# Altium schematic sheet BUCKEDUP.SchDoc
size A4; SheetNumber: 3; SheetTotal: 3
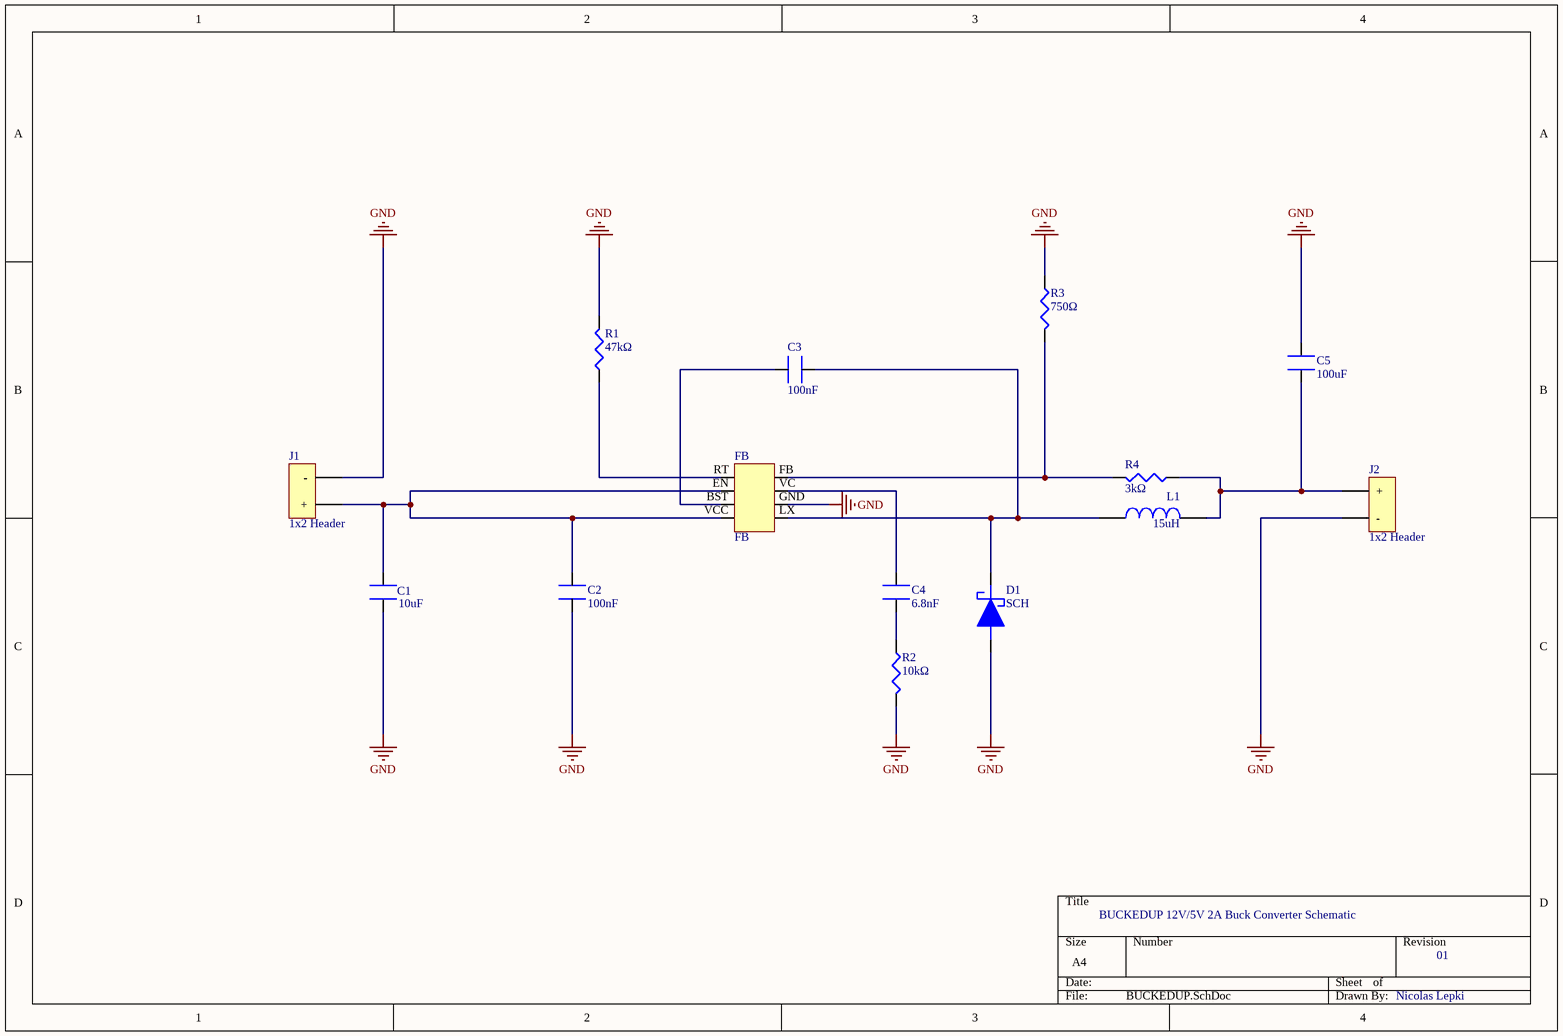
[diagram p0: BUCKEDUP.SchDoc]

## Parts
C1  10uF
C2  100nF
C3  100nF
C4  6.8nF
C5  100uF
D1  SCH
FB  FB
J1  1x2 Header
J2  1x2 Header
L1  15uH
R1  47kΩ
R2  10kΩ
R3  750Ω
R4  3kΩ

## Nets
GND: C1.2 C2.2 C5.2 D1.1 FB.GND J1.2(-) J2.2(-) R1.2 R2.2 R3.1
NetC1_1: C1.1 C2.1 FB.EN FB.VCC J1.1(+)
NetC3_1: C3.1 FB.BST
NetC3_2: C3.2 D1.2 FB.LX L1.1
NetC4_1: C4.1 FB.VC
NetC4_2: C4.2 R2.1
NetC5_1: C5.1 J2.1(+) L1.2 R4.1
NetFB_FB: FB.FB R3.2 R4.2
NetFB_RT: FB.RT R1.1

## Notes on the sheet
- BUCKEDUP 12V/5V 2A Buck Converter Schematic
- 01
- Nicolas Lepki

## Library data of the parts
C1 = KAM32LR71H106KL: 10uF Ceramic Capacitor, Multilayer, Ceramic, 50V, 10% +Tol, 10% -Tol, X7R, 15% TC, 10uF, Surface Mount, 1210; Manufacturer: KYOCERA AVX; Value: 10µF; Supplier: Mouser; Supplier Part Number: 581-KAM32LR71H106KL; Manufacturer Part Number: KAM32LR71H106KL; RoHS: Compliant; Category: Ceramic Capacitors; Stock: 8258; Dielectric Material: Ceramic; Height: 2.8mm; Length: 3.2mm; Lifecycle Status: Production; Max Operating Temperature: 125°C; Min Operating Temperature: -55°C; Mounting Technology: Surface Mount; Number of Terminals: 2; REACH SVHC: Yes; Voltage Rating (DC): 50V; Width: 2.5mm; ComponentLink1URL: https://datasheet.octopart.com:443/KAM32LR71H106KL-KYOCERA-AVX-datasheet-168937811.pdf?src-supplier=IHS; ComponentLink1Description: https://datasheet.octopart.com:443/KAM32LR71H106KL-KYOCERA-AVX-datasheet-168937811.pdf?src-supplier=IHS
C2 C3 = CL10F104ZB8NNNC: 0.1 uF Ceramic Capacitor, Multilayer, Ceramic, 50V, 80% +Tol, 20% -Tol, Y5V, -82~+22% TC, 100nF, Surface Mount, 0603 inch; Manufacturer: Samsung Electro-Mechanics; Supplier: Avnet; Supplier Part Number: CL10F104ZB8NNNC; Manufacturer Part Number: CL10F104ZB8NNNC; RoHS: Compliant; Category: Ceramic Capacitors; Stock: 108000; Value: 100nF; Case/Package: 0603; Case Code (Imperial): 0603; Case Code (Metric): 1608; China RoHS: Compliant; Contact Plating: Tin; Depth: 800µm; Dielectric: Y5V; Dielectric Material: Ceramic; Height: 800µm; Length: 1.6mm; Lifecycle Status: Production; Material: Ceramic; Max Operating Temperature: 85°C; Min Operating Temperature: -55°C; Mounting Technology: Surface Mount; Number of Terminals: 2; Radiation Hardening: No; REACH SVHC: Yes; Schedule B: 8532240020, 8532240020|8532240020|8532240020|8532240020|8532240020; Thickness: 889µm; Tolerance: 80%; Voltage: 50V; Voltage Rating: 50V; Voltage Rating (DC): 50V; Width: 800µm; ComponentLink1URL: https://datasheet.octopart.com:443/CL10F104ZB8NNNC-Samsung-Electro-Mechanics-datasheet-136482459.pdf?src-supplier=IHS; ComponentLink1Description: https://datasheet.octopart.com:443/CL10F104ZB8NNNC-Samsung-Electro-Mechanics-datasheet-136482459.pdf?src-supplier=IHS; ComponentLink2URL: https://datasheet.octopart.com:443/CL10F104ZB8NNNC-Samsung-Electro-Mechanics-datasheet-116891008.pdf?src-supplier=Future+Electronics; ComponentLink2Description: https://datasheet.octopart.com:443/CL10F104ZB8NNNC-Samsung-Electro-Mechanics-datasheet-116891008.pdf?src-supplier=Future+Electronics; ComponentLink3URL: https://datasheet.octopart.com:443/CL10F104ZB8NNNC-Samsung-Electro-Mechanics-datasheet-81462095.pdf?src-supplier=Future+Electronics; ComponentLink3Description: https://datasheet.octopart.com:443/CL10F104ZB8NNNC-Samsung-Electro-Mechanics-datasheet-81462095.pdf?src-supplier=Future+Electronics; ComponentLink4URL: https://datasheet.octopart.com:443/CL10F104ZB8NNNC-Samsung-datasheet-48647485.pdf?src-supplier=Future+Electronics; ComponentLink4Description: https://datasheet.octopart.com:443/CL10F104ZB8NNNC-Samsung-datasheet-48647485.pdf?src-supplier=Future+Electronics; ComponentLink5URL: https://datasheet.octopart.com:443/CL10F104ZB8NNNC-Samsung-datasheet-12535901.pdf?src-supplier=Future+Electronics; ComponentLink5Description: https://datasheet.octopart.com:443/CL10F104ZB8NNNC-Samsung-datasheet-12535901.pdf?src-supplier=Future+Electronics; ComponentLink6URL: https://datasheet.octopart.com:443/CL10F104ZB8NNNC-Samsung-datasheet-26669208.pdf?src-supplier=Future+Electronics; ComponentLink6Description: https://datasheet.octopart.com:443/CL10F104ZB8NNNC-Samsung-datasheet-26669208.pdf?src-supplier=Future+Electronics; ComponentLink7URL: https://datasheet.octopart.com:443/CL10F104ZB8NNNC-Samsung-Electro-Mechanics-datasheet-149136954.pdf?src-supplier=Future+Electronics; ComponentLink7Description: https://datasheet.octopart.com:443/CL10F104ZB8NNNC-Samsung-Electro-Mechanics-datasheet-149136954.pdf?src-supplier=Future+Electronics; ComponentLink8URL: https://datasheet.octopart.com/CL10F104ZB8NNNC-Samsung-Electro-Mechanics-datasheet-97040617.pdf; ComponentLink8Description: https://datasheet.octopart.com/CL10F104ZB8NNNC-Samsung-Electro-Mechanics-datasheet-97040617.pdf; ComponentLink9URL: https://datasheet.octopart.com/CL10F104ZB8NNNC-Samsung-Electro-Mechanics-datasheet-8324245.pdf; ComponentLink9Description: https://datasheet.octopart.com/CL10F104ZB8NNNC-Samsung-Electro-Mechanics-datasheet-8324245.pdf; ComponentLink10URL: https://datasheet.octopart.com:443/CL10F104ZB8NNNC-Samsung-datasheet-59220082.pdf?src-supplier=TME; ComponentLink10Description: https://datasheet.octopart.com:443/CL10F104ZB8NNNC-Samsung-datasheet-59220082.pdf?src-supplier=TME
C4 = CC0402JRX7R9BB682: 6.8nF Ceramic Capacitor, Ceramic, 50V, 5% +Tol, 5% -Tol, X7R, 15% TC, 0.0068uF, Surface Mount, 0402; Manufacturer: Yageo Group; Supplier: Avnet; Supplier Part Number: CC0402JRX7R9BB682; Manufacturer Part Number: CC0402JRX7R9BB682; RoHS: Compliant; Category: Ceramic Capacitors; Stock: 10000; Value: 6.8nF; Case/Package: 0402; Case Code (Imperial): 0402; Case Code (Metric): 1005; China RoHS: Compliant; Composition: Ceramic; Depth: 500µm; Dielectric: X7R; Dielectric Material: Ceramic; Halogen Free: Halogen Free; Height: 500µm; Lead Free: Lead Free; Length: 1mm; Lifecycle Status: Production; Max Operating Temperature: 125°C; Min Operating Temperature: -55°C; Mounting Technology: Surface Mount; Number of Terminals: 2; Packaging: Tape and Reel; REACH SVHC: Yes; Schedule B: 8532240020, 8532240020|8532240020|8532240020|8532240020|8532240020; Termination: SMD/SMT; Thickness: 558.8µm; Tolerance: 5%; Voltage Rating: 50V; Voltage Rating (DC): 50V; Weight: 652.039032µg; Width: 500µm; ComponentLink1URL: https://datasheet.octopart.com:443/CC0402JRX7R9BB682-Yageo-datasheet-177165144.pdf?src-supplier=IHS; ComponentLink1Description: https://datasheet.octopart.com:443/CC0402JRX7R9BB682-Yageo-datasheet-177165144.pdf?src-supplier=IHS; ComponentLink2URL: https://datasheet.octopart.com:443/CC0402JRX7R9BB682-Yageo-Group-datasheet-189192896.pdf?src-supplier=TME; ComponentLink2Description: https://datasheet.octopart.com:443/CC0402JRX7R9BB682-Yageo-Group-datasheet-189192896.pdf?src-supplier=TME; ComponentLink3URL: https://datasheet.octopart.com:443/CC0402JRX7R9BB682-Yageo-datasheet-182878143.pdf?src-supplier=Newark; ComponentLink3Description: https://datasheet.octopart.com:443/CC0402JRX7R9BB682-Yageo-datasheet-182878143.pdf?src-supplier=Newark; ComponentLink4URL: https://datasheet.octopart.com:443/CC0402JRX7R9BB682-Yageo-datasheet-147453679.pdf?src-supplier=Newark; ComponentLink4Description: https://datasheet.octopart.com:443/CC0402JRX7R9BB682-Yageo-datasheet-147453679.pdf?src-supplier=Newark; ComponentLink5URL: https://datasheet.octopart.com:443/CC0402JRX7R9BB682-Yageo-Group-datasheet-165992755.pdf?src-supplier=ODG+(Origin+Data+Global); ComponentLink5Description: https://datasheet.octopart.com:443/CC0402JRX7R9BB682-Yageo-Group-datasheet-165992755.pdf?src-supplier=ODG+(Origin+Data+Global); ComponentLink6URL: https://datasheet.octopart.com:443/CC0402JRX7R9BB682-Yageo-datasheet-151948686.pdf?src-supplier=Farnell; ComponentLink6Description: https://datasheet.octopart.com:443/CC0402JRX7R9BB682-Yageo-datasheet-151948686.pdf?src-supplier=Farnell; ComponentLink7URL: https://datasheet.octopart.com:443/CC0402JRX7R9BB682-Yageo-datasheet-137875056.pdf?src-supplier=Future+Electronics; ComponentLink7Description: https://datasheet.octopart.com:443/CC0402JRX7R9BB682-Yageo-datasheet-137875056.pdf?src-supplier=Future+Electronics; ComponentLink8URL: https://datasheet.octopart.com/Surface-Mount-Ceramic-Multilayer-Capacitors%3B-General-Purpose-%26-High-Capacitance-Class-2%2C-X7R-Yageo-datasheet-family-114.pdf; ComponentLink8Description: https://datasheet.octopart.com/Surface-Mount-Ceramic-Multilayer-Capacitors%3B-General-Purpose-%26-High-Capacitance-Class-2%2C-X7R-Yageo-datasheet-family-114.pdf; ComponentLink9URL: https://datasheet.octopart.com/CC0402JRX7R9BB682-Yageo-datasheet-10883670.pdf; ComponentLink9Description: https://datasheet.octopart.com/CC0402JRX7R9BB682-Yageo-datasheet-10883670.pdf; ComponentLink10URL: http://sigma.octopart.com:80/rohs_statement/Surface-Mount-Ceramic-Multilayer-Capacitors%3B-General-Purpose-%26-High-Capacitance-Class-2%2C-X7R-Yageo-family-124.pdf?src-supplier=Compliance+Statements; ComponentLink10Description: http://sigma.octopart.com:80/rohs_statement/Surface-Mount-Ceramic-Multilayer-Capacitors%3B-General-Purpose-%26-High-Capacitance-Class-2%2C-X7R-Yageo-family-124.pdf?src-supplier=Compliance+Statements; ComponentLink11URL: http://sigma.octopart.com:80/reach_statement/Surface-Mount-Ceramic-Multilayer-Capacitors%3B-General-Purpose-%26-High-Capacitance-Class-2%2C-X7R-Yageo-family-125.pdf?src-supplier=Compliance+Statements; ComponentLink11Description: http://sigma.octopart.com:80/reach_statement/Surface-Mount-Ceramic-Multilayer-Capacitors%3B-General-Purpose-%26-High-Capacitance-Class-2%2C-X7R-Yageo-family-125.pdf?src-supplier=Compliance+Statements; ComponentLink12URL: http://sigma.octopart.com:80/rohs_statement/Yageo-company-2.pdf?src-supplier=Compliance+Statements; ComponentLink12Description: http://sigma.octopart.com:80/rohs_statement/Yageo-company-2.pdf?src-supplier=Compliance+Statements; ComponentLink13URL: http://sigma.octopart.com:80/conflict_mineral_statement/Yageo-company-3.pdf?src-supplier=Compliance+Statements; ComponentLink13Description: http://sigma.octopart.com:80/conflict_mineral_statement/Yageo-company-3.pdf?src-supplier=Compliance+Statements
C5 = EMK325ABJ107MM-T: 100uF 1210 16 V ±20% Tolerance X5R SMT Multilayer Ceramic Capacitor; Manufacturer: Taiyo Yuden; Value: 100µF; Voltage Rating: 16V; Supplier: Avnet; Supplier Part Number: EMK325ABJ107MM-T; Manufacturer Part Number: EMK325ABJ107MM-T; RoHS: Compliant; Category: Ceramic Capacitors; Stock: 98000; Case/Package: 1210; Case Code (Imperial): 1210; Case Code (Metric): 3225; Composition: Ceramic; Dielectric: X5R; Dielectric Material: Ceramic; Height: 2.5mm; Length: 3.2mm; Lifecycle Status: NRND; Material: Ceramic; Max Operating Temperature: 85°C; Min Operating Temperature: -55°C; Mounting Technology: Surface Mount; Number of Terminals: 2; REACH SVHC: Yes; Termination: SMD/SMT; Thickness: 2.6924mm; Tolerance: 20%; Voltage Rating (DC): 16V; Width: 2.5mm; ComponentLink1URL: https://datasheet.octopart.com:443/EMK325ABJ107MM-T-Taiyo-Yuden-datasheet-99833418.pdf?src-supplier=Upverter; ComponentLink1Description: https://datasheet.octopart.com:443/EMK325ABJ107MM-T-Taiyo-Yuden-datasheet-99833418.pdf?src-supplier=Upverter; ComponentLink2URL: https://datasheet.octopart.com:443/EMK325ABJ107MM-T-Taiyo-Yuden-datasheet-181961904.pdf?src-supplier=Newark; ComponentLink2Description: https://datasheet.octopart.com:443/EMK325ABJ107MM-T-Taiyo-Yuden-datasheet-181961904.pdf?src-supplier=Newark; ComponentLink3URL: https://datasheet.octopart.com:443/EMK325ABJ107MM-T-Taiyo-Yuden-datasheet-10742123.pdf?src-supplier=Newark; ComponentLink3Description: https://datasheet.octopart.com:443/EMK325ABJ107MM-T-Taiyo-Yuden-datasheet-10742123.pdf?src-supplier=Newark; ComponentLink4URL: https://datasheet.octopart.com:443/EMK325ABJ107MM-T-Taiyo-Yuden-datasheet-140424376.pdf?src-supplier=Master+Electronics; ComponentLink4Description: https://datasheet.octopart.com:443/EMK325ABJ107MM-T-Taiyo-Yuden-datasheet-140424376.pdf?src-supplier=Master+Electronics; ComponentLink5URL: https://datasheet.octopart.com:443/CEEMK325ABJ107MM-T-Taiyo-Yuden-datasheet-62282836.pdf?src-supplier=Master+Electronics; ComponentLink5Description: https://datasheet.octopart.com:443/CEEMK325ABJ107MM-T-Taiyo-Yuden-datasheet-62282836.pdf?src-supplier=Master+Electronics; ComponentLink6URL: https://datasheet.octopart.com:443/EMK325ABJ107MM-T-Taiyo-Yuden-datasheet-12472494.pdf?src-supplier=Master+Electronics; ComponentLink6Description: https://datasheet.octopart.com:443/EMK325ABJ107MM-T-Taiyo-Yuden-datasheet-12472494.pdf?src-supplier=Master+Electronics; ComponentLink7URL: https://datasheet.octopart.com:443/EMK325ABJ107MM-T-Taiyo-Yuden-datasheet-151661615.pdf?src-supplier=Farnell; ComponentLink7Description: https://datasheet.octopart.com:443/EMK325ABJ107MM-T-Taiyo-Yuden-datasheet-151661615.pdf?src-supplier=Farnell; ComponentLink8URL: https://datasheet.octopart.com:443/EMK325ABJ107MM-T-Taiyo-Yuden-datasheet-138738940.pdf?src-supplier=Electro+Sonic; ComponentLink8Description: https://datasheet.octopart.com:443/EMK325ABJ107MM-T-Taiyo-Yuden-datasheet-138738940.pdf?src-supplier=Electro+Sonic; ComponentLink9URL: https://datasheet.octopart.com:443/EMK325ABJ107MM-T-Taiyo-Yuden-datasheet-27088864.pdf?src-supplier=Electro+Sonic; ComponentLink9Description: https://datasheet.octopart.com:443/EMK325ABJ107MM-T-Taiyo-Yuden-datasheet-27088864.pdf?src-supplier=Electro+Sonic; ComponentLink10URL: https://datasheet.octopart.com:443/EMK325ABJ107MM-T-Taiyo-Yuden-datasheet-13693548.pdf?src-supplier=Electro+Sonic; ComponentLink10Description: https://datasheet.octopart.com:443/EMK325ABJ107MM-T-Taiyo-Yuden-datasheet-13693548.pdf?src-supplier=Electro+Sonic; ComponentLink11URL: https://datasheet.octopart.com:443/EMK325ABJ107MM-T-Taiyo-Yuden-datasheet-99833423.pdf?src-supplier=Future+Electronics; ComponentLink11Description: https://datasheet.octopart.com:443/EMK325ABJ107MM-T-Taiyo-Yuden-datasheet-99833423.pdf?src-supplier=Future+Electronics
D1 = YQ3VWM10BTR: Rectifier Diode, Schottky, 1 Phase, 1 Element, 3A, 100V V(RRM), Silicon; Manufacturer: ROHM; Forward Voltage: 880mV; Max Forward Surge Current (Ifsm): 30A; Number of Elements: 1; Peak Reverse Current: 10µA; Supplier: DigiKey; Supplier Part Number: 846-YQ3VWM10BTRCT-ND; Manufacturer Part Number: YQ3VWM10BTR; RoHS: Compliant; Category: Rectifier Diodes; Stock: 2829; Lifecycle Status: Production; Max Operating Temperature: 175°C; Max Output current: 3A; Number of Terminals: 2; REACH SVHC: Yes; Reverse Standoff Voltage: 100V; ComponentLink1URL: https://datasheet.octopart.com:443/YQ3VWM10BTR-ROHM-datasheet-187817658.pdf?src-supplier=Farnell; ComponentLink1Description: https://datasheet.octopart.com:443/YQ3VWM10BTR-ROHM-datasheet-187817658.pdf?src-supplier=Farnell
FB = BD9G341AEFJ-LBE2: DC/DC Buck Regulator, Adjustable, 12V to 76V In, 1V to 76V/3A Out, 750kHz, HTSOP-8; Manufacturer: ROHM; Max Output current: 3A; Nominal Supply Voltage: 48V; Nominal Output Voltage: 5V; Number of Channels: 1; Switching Frequency: 750µHz; Supplier: Avnet; Supplier Part Number: BD9G341AEFJ-LBE2; Manufacturer Part Number: BD9G341AEFJ-LBE2; RoHS: Compliant; Category: Voltage Regulators - Switching; Stock: 277500; Height - Seated (Max): 1mm; Length: 4.9mm; Lifecycle Status: Production; Max Supply Voltage: 76V; Max Operating Temperature: 85°C; Min Input Voltage: 12V; Min Operating Temperature: -40°C; Number of Circuits: 1; Number of Terminals: 8; Output Current: 3A; Output Voltage: 1V; REACH SVHC: Yes; Schedule B: 8542390000, 8542390000|8542390000, 8542390000|8542390000|8542390000, 8542390000|8542390000|8542390000|8542390000; Terminal Pitch: 1.27mm; Topology: Buck; Width: 3.9mm; ComponentLink1URL: https://datasheet.octopart.com:443/BD9G341AEFJ-LBE2-ROHM-datasheet-181218989.pdf?src-supplier=IHS; ComponentLink1Description: https://datasheet.octopart.com:443/BD9G341AEFJ-LBE2-ROHM-datasheet-181218989.pdf?src-supplier=IHS; ComponentLink2URL: https://datasheet.octopart.com:443/BD9G341AEFJ-LBE2-Rohm-datasheet-142141732.pdf?src-supplier=Rohm+SCT; ComponentLink2Description: https://datasheet.octopart.com:443/BD9G341AEFJ-LBE2-Rohm-datasheet-142141732.pdf?src-supplier=Rohm+SCT
J1 J2 = 08432: Screw Terminals 5MM Pitch (2-PIN; Manufacturer: SparkFun; Supplier: DigiKey; Supplier Part Number: 1568-08432-ND; Manufacturer Part Number: 08432; Category: Uncategorized
L1 = PM4343.153NLT: 15uH PA4343 Power Inductor, up to 55A, 6.5mm Max Height; Manufacturer: Pulse Electronics; DC Resistance (DCR): 28mΩ; Value: 15µH; Max Current Rating: 9A; Number of Circuits: 1; Shielding: Yes; Test Frequency: 100kHz; Tolerance: 20%; Supplier: DigiKey; Supplier Part Number: 553-PM4343.153NLTCT-ND; Manufacturer Part Number: PM4343.153NLT; RoHS: Compliant; Category: Fixed Inductors; Stock: 1789; Case/Package: 5550; Height: 6.5mm; Lifecycle Status: Production; Max Operating Temperature: 125°C; Min Operating Temperature: -40°C; Number of Terminals: 2; REACH SVHC: Yes; Width: 12.8mm; ComponentLink1URL: https://datasheet.octopart.com:443/PM4343.153NLT-Pulse-datasheet-150476422.pdf?src-supplier=ODG+(Origin+Data+Global); ComponentLink1Description: https://datasheet.octopart.com:443/PM4343.153NLT-Pulse-datasheet-150476422.pdf?src-supplier=ODG+(Origin+Data+Global)
R1 = RC0603FR-0747KL: 47kΩ Res Thick Film 0603 47K Ohm 1% 1/10W ±100ppm/°C Molded SMD Paper T/R; Manufacturer: Yageo Group; Max Power Dissipation: 100mW; Voltage Rating: 50V; Working Voltage: 75V; Supplier: Avnet; Supplier Part Number: RC0603FR-0747KL; Manufacturer Part Number: RC0603FR-0747KL; RoHS: Compliant; Category: Chip SMD Resistors; Stock: 630000; Value: 47kΩ; Case/Package: 0603; Case Code (Imperial): 0603; Case Code (Metric): 1608; China RoHS: Non-Compliant; Composition: Thick Film; Depth: 800µm; Features: Moisture Resistant; Height: 450µm; Lead Free: Lead Free; Length: 1.6mm; Lifecycle Status: Production; Max Operating Temperature: 155°C; Military Standard: Not; Min Operating Temperature: -55°C; Mounting Technology: Surface Mount; Pins: 2; Number of Terminals: 2; Number of Terminations: 2; Packaging: Tape and Reel; Power Dissipation: 100mW; Power Rating: 100mW; Radiation Hardening: No; REACH SVHC: Yes; Schedule B: 8533210045, 8533210045|8533210045|8533210045|8533210045|8533210045|8533210045|8533210045|8533210045|8533210045|8533210045|8533210045|8533210045|8533210045, 8533210045|8533210045|8533210045|8533210045|8533210045|8533210045|8533210045|8533210045|8533210045|8533210045|8533210045|8533210045|8533210045|8533210045, 8533210045|8533210045|8533210045|8533210045|8533210045|8533210045|8533210045|8533210045|8533210045|8533210045|8533210045|8533210045|8533210045|8533210045|8533210045; Temperature Coefficient: 100ppm/°C; Termination: SMD/SMT; Tolerance: 1%; Voltage Rating (AC): 50V; Voltage Rating (DC): 50V; Width: 800µm; ComponentLink1URL: https://datasheet.octopart.com:443/RC0603FR-0747KL-Yageo-datasheet-175887523.pdf?src-supplier=IHS; ComponentLink1Description: https://datasheet.octopart.com:443/RC0603FR-0747KL-Yageo-datasheet-175887523.pdf?src-supplier=IHS; ComponentLink2URL: https://datasheet.octopart.com:443/RC0603FR-0747KL-Yageo-datasheet-62067350.pdf?src-supplier=Newark; ComponentLink2Description: https://datasheet.octopart.com:443/RC0603FR-0747KL-Yageo-datasheet-62067350.pdf?src-supplier=Newark; ComponentLink3URL: https://datasheet.octopart.com:443/RC0603FR-0747KL-Yageo-datasheet-34211833.pdf?src-supplier=Newark; ComponentLink3Description: https://datasheet.octopart.com:443/RC0603FR-0747KL-Yageo-datasheet-34211833.pdf?src-supplier=Newark; ComponentLink4URL: https://datasheet.octopart.com:443/RC0603FR-0747KL-Yageo-datasheet-141265859.pdf?src-supplier=Upverter; ComponentLink4Description: https://datasheet.octopart.com:443/RC0603FR-0747KL-Yageo-datasheet-141265859.pdf?src-supplier=Upverter; ComponentLink5URL: https://datasheet.octopart.com:443/RC0603FR-0747KL-Yageo-datasheet-103092701.pdf?src-supplier=Upverter; ComponentLink5Description: https://datasheet.octopart.com:443/RC0603FR-0747KL-Yageo-datasheet-103092701.pdf?src-supplier=Upverter; ComponentLink6URL: https://sigma.octopart.com:443/138820526/technical_drawing/Yageo-RC0603FR-0747KL.pdf?src-supplier=Upverter; ComponentLink6Description: https://sigma.octopart.com:443/138820526/technical_drawing/Yageo-RC0603FR-0747KL.pdf?src-supplier=Upverter; ComponentLink7URL: https://datasheet.octopart.com:443/RC0603FR-0747KL-Yageo-datasheet-8328172.pdf?src-supplier=element14+APAC; ComponentLink7Description: https://datasheet.octopart.com:443/RC0603FR-0747KL-Yageo-datasheet-8328172.pdf?src-supplier=element14+APAC; ComponentLink8URL: https://datasheet.octopart.com:443/RC0603FR-0747KL-Yageo-datasheet-164759695.pdf?src-supplier=Future+Electronics; ComponentLink8Description: https://datasheet.octopart.com:443/RC0603FR-0747KL-Yageo-datasheet-164759695.pdf?src-supplier=Future+Electronics; ComponentLink9URL: https://datasheet.octopart.com:443/RC0603FR-0747KL-Yageo-datasheet-137700087.pdf?src-supplier=Future+Electronics; ComponentLink9Description: https://datasheet.octopart.com:443/RC0603FR-0747KL-Yageo-datasheet-137700087.pdf?src-supplier=Future+Electronics; ComponentLink10URL: https://datasheet.octopart.com:443/RC0603FR-0747KL-Yageo-datasheet-27584510.pdf?src-supplier=Future+Electronics; ComponentLink10Description: https://datasheet.octopart.com:443/RC0603FR-0747KL-Yageo-datasheet-27584510.pdf?src-supplier=Future+Electronics; ComponentLink11URL: https://datasheet.octopart.com:443/RC0603FR-0747KL-Yageo-datasheet-15599030.pdf?src-supplier=Future+Electronics; ComponentLink11Description: https://datasheet.octopart.com:443/RC0603FR-0747KL-Yageo-datasheet-15599030.pdf?src-supplier=Future+Electronics; ComponentLink12URL: https://datasheet.octopart.com:443/RC0603FR-0747KL-Yageo-datasheet-12596169.pdf?src-supplier=Future+Electronics; ComponentLink12Description: https://datasheet.octopart.com:443/RC0603FR-0747KL-Yageo-datasheet-12596169.pdf?src-supplier=Future+Electronics; ComponentLink13URL: https://datasheet.octopart.com:443/RC0603FR-0747KL-Yageo-datasheet-79472498.pdf?src-supplier=Megastar; ComponentLink13Description: https://datasheet.octopart.com:443/RC0603FR-0747KL-Yageo-datasheet-79472498.pdf?src-supplier=Megastar; ComponentLink14URL: https://datasheet.octopart.com/RC0603FR-0747KL-Yageo-datasheet-73766026.pdf; ComponentLink14Description: https://datasheet.octopart.com/RC0603FR-0747KL-Yageo-datasheet-73766026.pdf; ComponentLink15URL: https://datasheet.octopart.com:443/RC0603FR-0747KL-Yageo-datasheet-13691069.pdf?src-supplier=Farnell; ComponentLink15Description: https://datasheet.octopart.com:443/RC0603FR-0747KL-Yageo-datasheet-13691069.pdf?src-supplier=Farnell; ComponentLink16URL: https://datasheet.octopart.com:443/RC0603FR-0747KL-Yageo-datasheet-118562.pdf?src-supplier=DigiKey; ComponentLink16Description: https://datasheet.octopart.com:443/RC0603FR-0747KL-Yageo-datasheet-118562.pdf?src-supplier=DigiKey; ComponentLink17URL: https://datasheet.octopart.com:443/RC0603FR-0747KL-Yageo-datasheet-499455.pdf?src-supplier=element14; ComponentLink17Description: https://datasheet.octopart.com:443/RC0603FR-0747KL-Yageo-datasheet-499455.pdf?src-supplier=element14; ComponentLink18URL: http://sigma.octopart.com:80/rohs_statement/Yageo-company-2.pdf?src-supplier=Compliance+Statements; ComponentLink18Description: http://sigma.octopart.com:80/rohs_statement/Yageo-company-2.pdf?src-supplier=Compliance+Statements; ComponentLink19URL: http://sigma.octopart.com:80/conflict_mineral_statement/Yageo-company-3.pdf?src-supplier=Compliance+Statements; ComponentLink19Description: http://sigma.octopart.com:80/conflict_mineral_statement/Yageo-company-3.pdf?src-supplier=Compliance+Statements
R2 = RC0603FR-07100KL: 10kΩ 100Mw Thick Film Resistors 100Ppm/ 1% 10K 0603 Chip Resistor Surface Mount Rohs; Manufacturer: Yageo Group; Temperature Coefficient: 100ppm/°C; Voltage Rating: 75V; Voltage Rating (DC): 50V; Supplier: Avnet; Supplier Part Number: RC0603FR-07100KL; Manufacturer Part Number: RC0603FR-07100KL; RoHS: Compliant; Category: Chip SMD Resistors; Stock: 930000; Case/Package: 0603; Case Code (Imperial): 0603; Case Code (Metric): 0603; China RoHS: Non-Compliant; Composition: Thick Film; Depth: 800µm; Height: 450µm; Lead Free: Lead Free; Length: 1.6mm; Lifecycle Status: Production; Max Operating Temperature: 155°C; Military Standard: Not; Min Operating Temperature: -55°C; Mounting Technology: Surface Mount; Pins: 2; Number of Terminals: 2; Number of Terminations: 2; Packaging: Tape & Reel; Power Dissipation: 100mW; Power Rating: 100mW; REACH SVHC: Yes; Value: 10kΩ; Schedule B: 8533210045, 8533210045|8533210045, 8533210045|8533210045|8533210045, 8533210045|8533210045|8533210045|8533210045; Termination: SMD/SMT; Tolerance: 1%; Width: 800µm; Working Voltage: 75V; ComponentLink1URL: https://datasheet.octopart.com:443/RC0603FR-07100KL-Yageo-datasheet-175887523.pdf?src-supplier=IHS; ComponentLink1Description: https://datasheet.octopart.com:443/RC0603FR-07100KL-Yageo-datasheet-175887523.pdf?src-supplier=IHS; ComponentLink2URL: https://datasheet.octopart.com:443/RC0603FR-07100KL-Yageo-datasheet-8328172.pdf?src-supplier=element14+APAC; ComponentLink2Description: https://datasheet.octopart.com:443/RC0603FR-07100KL-Yageo-datasheet-8328172.pdf?src-supplier=element14+APAC; ComponentLink3URL: https://datasheet.octopart.com:443/RC0603FR-07100KL-Yageo-datasheet-17842380.pdf?src-supplier=element14+APAC; ComponentLink3Description: https://datasheet.octopart.com:443/RC0603FR-07100KL-Yageo-datasheet-17842380.pdf?src-supplier=element14+APAC; ComponentLink4URL: https://datasheet.octopart.com:443/RC0603FR-07100KL-Yageo-datasheet-141265859.pdf?src-supplier=Upverter; ComponentLink4Description: https://datasheet.octopart.com:443/RC0603FR-07100KL-Yageo-datasheet-141265859.pdf?src-supplier=Upverter; ComponentLink5URL: https://datasheet.octopart.com:443/RC0603FR-07100KL-Yageo-datasheet-103092701.pdf?src-supplier=Upverter; ComponentLink5Description: https://datasheet.octopart.com:443/RC0603FR-07100KL-Yageo-datasheet-103092701.pdf?src-supplier=Upverter; ComponentLink6URL: https://sigma.octopart.com:443/138820526/technical_drawing/Yageo-RC0603FR-07100KL.pdf?src-supplier=Upverter; ComponentLink6Description: https://sigma.octopart.com:443/138820526/technical_drawing/Yageo-RC0603FR-07100KL.pdf?src-supplier=Upverter; ComponentLink7URL: https://datasheet.octopart.com:443/RC0603FR-07100KL-Yageo-datasheet-98239111.pdf?src-supplier=Upverter; ComponentLink7Description: https://datasheet.octopart.com:443/RC0603FR-07100KL-Yageo-datasheet-98239111.pdf?src-supplier=Upverter; ComponentLink8URL: https://datasheet.octopart.com:443/RC0603FR-07100KL-Yageo-datasheet-12596169.pdf?src-supplier=Newark; ComponentLink8Description: https://datasheet.octopart.com:443/RC0603FR-07100KL-Yageo-datasheet-12596169.pdf?src-supplier=Newark; ComponentLink9URL: https://datasheet.octopart.com:443/RC0603FR-07100KL-Yageo-datasheet-34211833.pdf?src-supplier=Newark; ComponentLink9Description: https://datasheet.octopart.com:443/RC0603FR-07100KL-Yageo-datasheet-34211833.pdf?src-supplier=Newark; ComponentLink10URL: https://datasheet.octopart.com:443/RC0603FR-07100KL-Yageo-datasheet-62067350.pdf?src-supplier=Farnell; ComponentLink10Description: https://datasheet.octopart.com:443/RC0603FR-07100KL-Yageo-datasheet-62067350.pdf?src-supplier=Farnell; ComponentLink11URL: https://datasheet.octopart.com:443/RC0603FR-07100KL-Yageo-datasheet-13691069.pdf?src-supplier=Farnell; ComponentLink11Description: https://datasheet.octopart.com:443/RC0603FR-07100KL-Yageo-datasheet-13691069.pdf?src-supplier=Farnell; ComponentLink12URL: https://datasheet.octopart.com:443/RC0603FR-07100KL-Yageo-datasheet-164759695.pdf?src-supplier=Future+Electronics; ComponentLink12Description: https://datasheet.octopart.com:443/RC0603FR-07100KL-Yageo-datasheet-164759695.pdf?src-supplier=Future+Electronics; ComponentLink13URL: https://datasheet.octopart.com:443/RC0603FR-07100KL-Yageo-datasheet-137700087.pdf?src-supplier=Future+Electronics; ComponentLink13Description: https://datasheet.octopart.com:443/RC0603FR-07100KL-Yageo-datasheet-137700087.pdf?src-supplier=Future+Electronics; ComponentLink14URL: https://datasheet.octopart.com:443/RC0603FR-07100KL-Yageo-datasheet-27584510.pdf?src-supplier=Future+Electronics; ComponentLink14Description: https://datasheet.octopart.com:443/RC0603FR-07100KL-Yageo-datasheet-27584510.pdf?src-supplier=Future+Electronics; ComponentLink15URL: https://datasheet.octopart.com:443/RC0603FR-07100KL-Yageo-datasheet-15599030.pdf?src-supplier=Future+Electronics; ComponentLink15Description: https://datasheet.octopart.com:443/RC0603FR-07100KL-Yageo-datasheet-15599030.pdf?src-supplier=Future+Electronics; ComponentLink16URL: https://datasheet.octopart.com:443/RC0603FR-07100KL-Yageo-datasheet-8324193.pdf?src-supplier=Future+Electronics; ComponentLink16Description: https://datasheet.octopart.com:443/RC0603FR-07100KL-Yageo-datasheet-8324193.pdf?src-supplier=Future+Electronics; ComponentLink17URL: https://datasheet.octopart.com:443/RC0603FR-07100KL-Yageo-datasheet-79472498.pdf?src-supplier=Megastar; ComponentLink17Description: https://datasheet.octopart.com:443/RC0603FR-07100KL-Yageo-datasheet-79472498.pdf?src-supplier=Megastar; ComponentLink18URL: https://datasheet.octopart.com/RC0603FR-07100KL-Yageo-datasheet-73766026.pdf; ComponentLink18Description: https://datasheet.octopart.com/RC0603FR-07100KL-Yageo-datasheet-73766026.pdf; ComponentLink19URL: https://datasheet.octopart.com:443/RC0603FR-07100KL-Yageo-datasheet-30459151.pdf?src-supplier=Seeed+Studio; ComponentLink19Description: https://datasheet.octopart.com:443/RC0603FR-07100KL-Yageo-datasheet-30459151.pdf?src-supplier=Seeed+Studio; ComponentLink20URL: https://datasheet.octopart.com:443/RC0603FR-07100KL-Yageo-datasheet-118562.pdf?src-supplier=DigiKey; ComponentLink20Description: https://datasheet.octopart.com:443/RC0603FR-07100KL-Yageo-datasheet-118562.pdf?src-supplier=DigiKey; ComponentLink21URL: https://datasheet.octopart.com:443/RC0603FR-07100KL-Yageo-datasheet-503470.pdf?src-supplier=element14; ComponentLink21Description: https://datasheet.octopart.com:443/RC0603FR-07100KL-Yageo-datasheet-503470.pdf?src-supplier=element14; ComponentLink22URL: http://sigma.octopart.com:80/rohs_statement/Yageo-company-2.pdf?src-supplier=Compliance+Statements; ComponentLink22Description: http://sigma.octopart.com:80/rohs_statement/Yageo-company-2.pdf?src-supplier=Compliance+Statements; ComponentLink23URL: http://sigma.octopart.com:80/conflict_mineral_statement/Yageo-company-3.pdf?src-supplier=Compliance+Statements; ComponentLink23Description: http://sigma.octopart.com:80/conflict_mineral_statement/Yageo-company-3.pdf?src-supplier=Compliance+Statements
R3 = ERJ-3EKF75R0V: 750Ω Resistor Thick Film 0603 750 Ohm 1% 1/10W 100ppm/C Molded SMD Punched Carrier T/R; Manufacturer: Panasonic; Manufacturer Lifecycle Status: ACTIVE; Part Series: Precision Thick Film Chip Resistors; Max Power Dissipation: 100mW; Temperature Coefficient: 100ppm/°C; Voltage Rating: 75V; Supplier: Newark; Supplier Part Number: ERJ3EKF75R0V; Manufacturer Part Number: ERJ-3EKF75R0V; RoHS: Compliant; Category: Chip SMD Resistors; Stock: 30426; Pricing: 10=0.031, 100=0.018, 1000=0.016 (CAD); Case/Package: 0603; Case Code (Imperial): 0603; China RoHS: Non-Compliant; Composition: Thick Film; Contact Plating: Tin; Depth: 800µm; Features: Automotive AEC-Q200; Height: 450µm; Length: 1.6mm; Lifecycle Status: Production; Max Operating Temperature: 155°C; Military Standard: Not; Min Operating Temperature: -55°C; Mounting Technology: Surface Mount; Number of Terminals: 2; Number of Terminations: 2; Packaging: Cut Tape; Power Dissipation: 100mW; Power Rating: 100mW; Radiation Hardening: No; REACH SVHC: Yes; Value: 750Ω; Schedule B: 8533210045, 8533210045|8533210045|8533210045|8533210045|8533210045|8533210045|8533210045|8533210045|8533210045|8533210045|8533210045|8533210045|8533210045|8533210045|8533210045|8533210045|8533210045|8533210045|8533210045|8533210045|8533210045|8533210045|8533210045|85; Termination: SMD/SMT; Tolerance: 1%; Width: 800µm; Working Voltage: 75V; ComponentLink1URL: https://datasheet.octopart.com:443/ERJ-3EKF75R0V-Panasonic-datasheet-82288794.pdf?src-supplier=Panasonic; ComponentLink1Description: https://datasheet.octopart.com:443/ERJ-3EKF75R0V-Panasonic-datasheet-82288794.pdf?src-supplier=Panasonic; ComponentLink2URL: https://datasheet.octopart.com:443/ERJ-3EKF75R0V-Panasonic-datasheet-13266541.pdf?src-supplier=RS+(Formerly+Allied+Electronics); ComponentLink2Description: https://datasheet.octopart.com:443/ERJ-3EKF75R0V-Panasonic-datasheet-13266541.pdf?src-supplier=RS+(Formerly+Allied+Electronics); ComponentLink3URL: https://datasheet.octopart.com:443/ERJ-3EKF75R0V-Panasonic-datasheet-10025800.pdf?src-supplier=Future+Electronics; ComponentLink3Description: https://datasheet.octopart.com:443/ERJ-3EKF75R0V-Panasonic-datasheet-10025800.pdf?src-supplier=Future+Electronics; ComponentLink4URL: https://datasheet.octopart.com:443/ERJ-3EKF75R0V-Panasonic-datasheet-8853621.pdf?src-supplier=Future+Electronics; ComponentLink4Description: https://datasheet.octopart.com:443/ERJ-3EKF75R0V-Panasonic-datasheet-8853621.pdf?src-supplier=Future+Electronics; ComponentLink5URL: https://datasheet.octopart.com:443/ERJ-3EKF75R0V-Panasonic-datasheet-5313456.pdf?src-supplier=Newark; ComponentLink5Description: https://datasheet.octopart.com:443/ERJ-3EKF75R0V-Panasonic-datasheet-5313456.pdf?src-supplier=Newark; ComponentLink6URL: https://datasheet.octopart.com:443/ERJ-3EKF75R0V-Panasonic-datasheet-48891056.pdf?src-supplier=Newark; ComponentLink6Description: https://datasheet.octopart.com:443/ERJ-3EKF75R0V-Panasonic-datasheet-48891056.pdf?src-supplier=Newark; ComponentLink7URL: https://datasheet.octopart.com:443/ERJ-3EKF75R0V-Panasonic-datasheet-168681906.pdf?src-supplier=Farnell; ComponentLink7Description: https://datasheet.octopart.com:443/ERJ-3EKF75R0V-Panasonic-datasheet-168681906.pdf?src-supplier=Farnell; ComponentLink8URL: https://datasheet.octopart.com:443/ERJ-3EKF75R0V-Panasonic-datasheet-136608610.pdf?src-supplier=Farnell; ComponentLink8Description: https://datasheet.octopart.com:443/ERJ-3EKF75R0V-Panasonic-datasheet-136608610.pdf?src-supplier=Farnell; ComponentLink9URL: https://datasheet.octopart.com:443/ERJ-3EKF75R0V-Panasonic---ECG-datasheet-15994758.pdf?src-supplier=Farnell; ComponentLink9Description: https://datasheet.octopart.com:443/ERJ-3EKF75R0V-Panasonic---ECG-datasheet-15994758.pdf?src-supplier=Farnell; ComponentLink10URL: https://datasheet.octopart.com:443/ERJ-3EKF75R0V-Panasonic-datasheet-154766169.pdf?src-supplier=Master+Electronics; ComponentLink10Description: https://datasheet.octopart.com:443/ERJ-3EKF75R0V-Panasonic-datasheet-154766169.pdf?src-supplier=Master+Electronics; ComponentLink11URL: https://datasheet.octopart.com:443/ERJ3EKF75R0V-Panasonic-datasheet-138819429.pdf?src-supplier=Burklin+Elektronik; ComponentLink11Description: https://datasheet.octopart.com:443/ERJ3EKF75R0V-Panasonic-datasheet-138819429.pdf?src-supplier=Burklin+Elektronik; ComponentLink12URL: https://datasheet.octopart.com/ERJ-3EKF75R0V-Panasonic-datasheet-78375410.pdf; ComponentLink12Description: https://datasheet.octopart.com/ERJ-3EKF75R0V-Panasonic-datasheet-78375410.pdf; ComponentLink13URL: https://datasheet.octopart.com:443/ERJ-3EKF75R0V-Panasonic-datasheet-11542829.pdf?src-supplier=Arrow+Electronics; ComponentLink13Description: https://datasheet.octopart.com:443/ERJ-3EKF75R0V-Panasonic-datasheet-11542829.pdf?src-supplier=Arrow+Electronics; ComponentLink14URL: https://datasheet.octopart.com:443/ERJ-3EKF75R0V-Panasonic-datasheet-7538305.pdf?src-supplier=Jameco; ComponentLink14Description: https://datasheet.octopart.com:443/ERJ-3EKF75R0V-Panasonic-datasheet-7538305.pdf?src-supplier=Jameco; ComponentLink15URL: https://datasheet.octopart.com:443/ERJ-3EKF75R0V-Panasonic-datasheet-118621.pdf?src-supplier=DigiKey; ComponentLink15Description: https://datasheet.octopart.com:443/ERJ-3EKF75R0V-Panasonic-datasheet-118621.pdf?src-supplier=DigiKey; ComponentLink16URL: https://datasheet.octopart.com:443/ERJ-3EKF75R0V-Panasonic-datasheet-41391857.pdf?src-supplier=Electro+Sonic; ComponentLink16Description: https://datasheet.octopart.com:443/ERJ-3EKF75R0V-Panasonic-datasheet-41391857.pdf?src-supplier=Electro+Sonic
R4 = RMCF0603FT3K00: 3kΩ Res Thick Film 0603 3K Ohm 1% 0.1W(1/10W) ±100ppm/C Pad SMD Automotive T/R; Manufacturer: Stackpole Electronics; Max Power Dissipation: 100mW; Temperature Coefficient: 100ppm/°C; Voltage Rating: 75V; Supplier: Avnet; Supplier Part Number: RMCF0603FT3K00; Manufacturer Part Number: RMCF0603FT3K00; RoHS: Compliant; Category: Chip SMD Resistors; Stock: 75000; Case/Package: 0603; Case Code (Imperial): 0603; Case Code (Metric): 1608; China RoHS: Non-Compliant; Composition: Thick Film; Contact Plating: Tin; Features: Automotive AEC-Q200; Height: 450µm; Lead Free: Lead Free; Length: 1.5494mm; Lifecycle Status: Production; Max Operating Temperature: 155°C; Min Operating Temperature: -55°C; Mounting Technology: Surface Mount; Number of Terminals: 2; Number of Terminations: 2; Packaging: Tape & Reel (TR); Power Dissipation: 100mW; Power Rating: 100mW; Radiation Hardening: No; REACH SVHC: Yes; Value: 3kΩ; Schedule B: 8533210045, 8533210045|8533210045, 8533210045|8533210045|8533210045, 8533210045|8533210045|8533210045|8533210045; Tolerance: 1%; Width: 800µm; Working Voltage: 75V; ComponentLink1URL: https://datasheet.octopart.com:443/RMCF0603FT3K00-Stackpole-Electronics-datasheet-182148065.pdf?src-supplier=IHS; ComponentLink1Description: https://datasheet.octopart.com:443/RMCF0603FT3K00-Stackpole-Electronics-datasheet-182148065.pdf?src-supplier=IHS; ComponentLink2URL: https://datasheet.octopart.com:443/RMCF0603FT3K00-Stackpole-Electronics-datasheet-28504820.pdf?src-supplier=Future+Electronics; ComponentLink2Description: https://datasheet.octopart.com:443/RMCF0603FT3K00-Stackpole-Electronics-datasheet-28504820.pdf?src-supplier=Future+Electronics; ComponentLink3URL: https://datasheet.octopart.com:443/RMCF0603FT3K00-Stackpole-Electronics-datasheet-141193804.pdf?src-supplier=Stackpole+Electronics; ComponentLink3Description: https://datasheet.octopart.com:443/RMCF0603FT3K00-Stackpole-Electronics-datasheet-141193804.pdf?src-supplier=Stackpole+Electronics; ComponentLink4URL: https://datasheet.octopart.com:443/RMCF0603FT3K00-Stackpole-Electronics-datasheet-62091608.pdf?src-supplier=Stackpole+Electronics; ComponentLink4Description: https://datasheet.octopart.com:443/RMCF0603FT3K00-Stackpole-Electronics-datasheet-62091608.pdf?src-supplier=Stackpole+Electronics; ComponentLink5URL: https://datasheet.octopart.com:443/RMCF0603FT3K00-Stackpole-Electronics-datasheet-12534581.pdf?src-supplier=Stackpole+Electronics; ComponentLink5Description: https://datasheet.octopart.com:443/RMCF0603FT3K00-Stackpole-Electronics-datasheet-12534581.pdf?src-supplier=Stackpole+Electronics; ComponentLink6URL: https://datasheet.octopart.com:443/RMCF0603FT3K00-Stackpole-Electronics-datasheet-10788263.pdf?src-supplier=Stackpole+Electronics; ComponentLink6Description: https://datasheet.octopart.com:443/RMCF0603FT3K00-Stackpole-Electronics-datasheet-10788263.pdf?src-supplier=Stackpole+Electronics; ComponentLink7URL: https://datasheet.octopart.com:443/RMCF0603FT3K00-Stackpole-Electronics-datasheet-154799224.pdf?src-supplier=Master+Electronics; ComponentLink7Description: https://datasheet.octopart.com:443/RMCF0603FT3K00-Stackpole-Electronics-datasheet-154799224.pdf?src-supplier=Master+Electronics; ComponentLink8URL: http://sigma.octopart.com:80/15940719/materials_sheet/Stackpole-Electronics-RMCF0603FT3K00.pdf?src-supplier=Compliance+Statements; ComponentLink8Description: http://sigma.octopart.com:80/15940719/materials_sheet/Stackpole-Electronics-RMCF0603FT3K00.pdf?src-supplier=Compliance+Statements; ComponentLink9URL: http://sigma.octopart.com:80/141158211/reach_statement/Stackpole-Electronics-RMCF0603FT3K00.pdf?src-supplier=Compliance+Statements; ComponentLink9Description: http://sigma.octopart.com:80/141158211/reach_statement/Stackpole-Electronics-RMCF0603FT3K00.pdf?src-supplier=Compliance+Statements; ComponentLink10URL: http://sigma.octopart.com:80/141158212/rohs_statement/Stackpole-Electronics-RMCF0603FT3K00.pdf?src-supplier=Compliance+Statements; ComponentLink10Description: http://sigma.octopart.com:80/141158212/rohs_statement/Stackpole-Electronics-RMCF0603FT3K00.pdf?src-supplier=Compliance+Statements